# EAGLE schematic omnetics_nano_breakout_reverse_v2 (EAGLE 8.2.2)
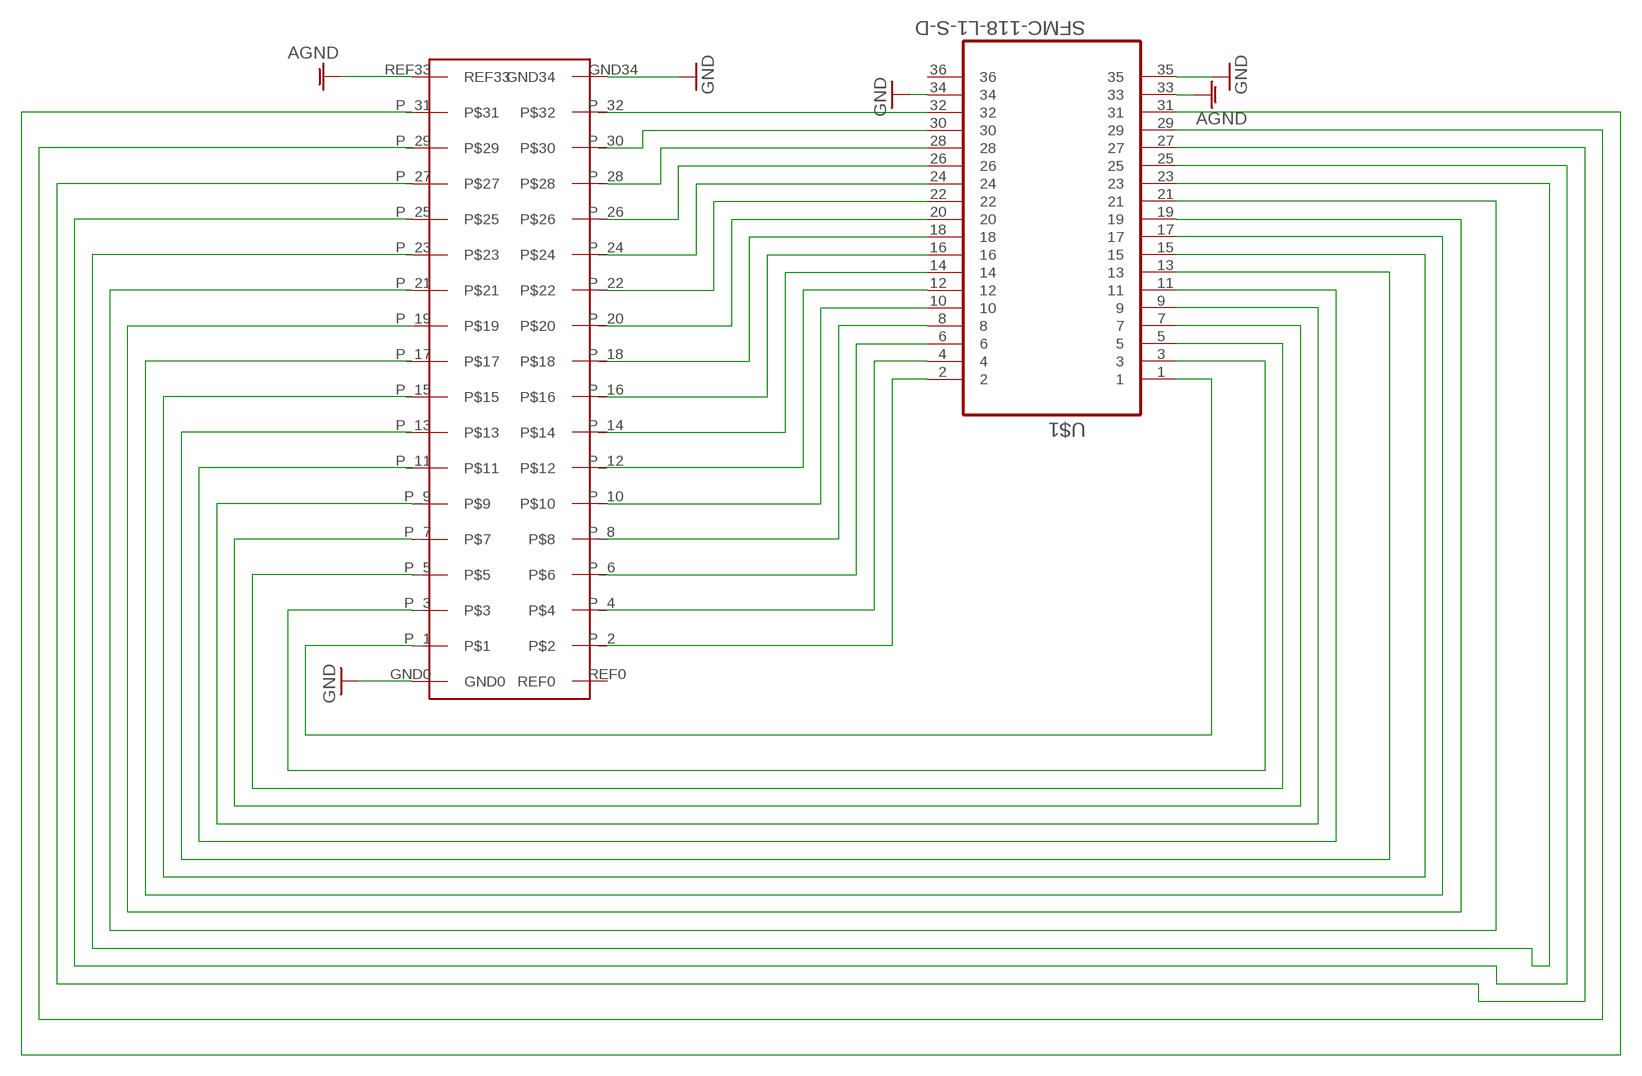
[diagram p0: schematic, sheet 1]

## Parts
U$1  SFMC-118-L1-S-D  [SFMC-118-L1-S-D]
U$2  OMNETICS_NANO_18X2  [OMNETICS_NANO_18X2]

## Nets
AGND: U$1.33 U$2.REF33
GND: U$1.34 U$1.35 U$2.GND0 U$2.GND34
N$1: U$1.1 U$2.P_1
N$2: U$1.2 U$2.P_2
N$3: U$1.4 U$2.P_4
N$4: U$1.6 U$2.P_6
N$5: U$1.8 U$2.P_8
N$6: U$1.10 U$2.P_10
N$7: U$1.12 U$2.P_12
N$8: U$1.14 U$2.P_14
N$9: U$1.16 U$2.P_16
N$10: U$1.18 U$2.P_18
N$11: U$1.20 U$2.P_20
N$12: U$1.22 U$2.P_22
N$13: U$1.24 U$2.P_24
N$14: U$1.26 U$2.P_26
N$15: U$1.28 U$2.P_28
N$16: U$1.30 U$2.P_30
N$17: U$1.32 U$2.P_32
N$18: U$1.3 U$2.P_3
N$19: U$1.5 U$2.P_5
N$20: U$1.7 U$2.P_7
N$21: U$1.9 U$2.P_9
N$22: U$1.11 U$2.P_11
N$23: U$1.13 U$2.P_13
N$24: U$1.15 U$2.P_15
N$25: U$1.17 U$2.P_17
N$26: U$1.19 U$2.P_19
N$27: U$1.21 U$2.P_21
N$28: U$1.23 U$2.P_23
N$29: U$1.25 U$2.P_25
N$30: U$1.27 U$2.P_27
N$31: U$1.29 U$2.P_29
N$32: U$1.31 U$2.P_31
Unconnected: U$1.36 U$2.REF0

## Library data of the parts
U$1 = tuckerLib:SFMC-118-L1-S-D
U$2 = Sombeck_lib:OMNETICS_NANO_18X2